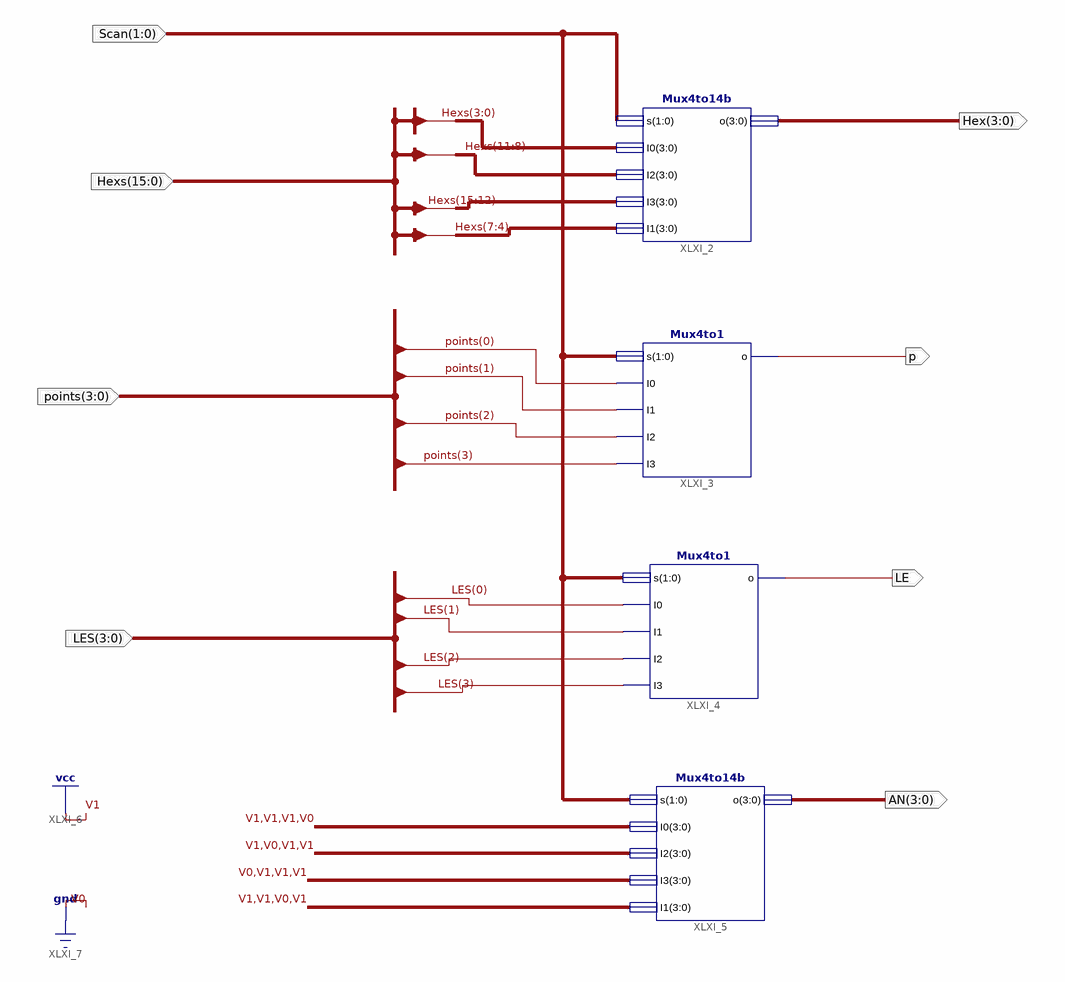
[diagram p0: schematic sheet 1]
// Xilinx ISE schematic DisplaySync.sch (kintex7) as structural Verilog: 4 symbols, 8 ports
module DisplaySync (
  input  [1:0] Scan,
  input  [15:0] Hexs,
  input  [3:0] points,
  input  [3:0] LES,
  output [3:0] Hex,
  output p,
  output LE,
  output [3:0] AN
);

  Mux4to14b XLXI_2 (.s(Scan), .I0(Hexs[3:0]), .I2(Hexs[11:8]), .I3(Hexs[15:12]), .I1(Hexs[7:4]), .o(Hex));
  Mux4to1 XLXI_3 (.s(Scan), .I0(points[0]), .I1(points[1]), .I2(points[2]), .I3(points[3]), .o(p));
  Mux4to1 XLXI_4 (.s(Scan), .I0(LES[0]), .I1(LES[1]), .I2(LES[2]), .I3(LES[3]), .o(LE));
  Mux4to14b XLXI_5 (.s(Scan), .I0(4'b1110), .I2(4'b1011), .I3(4'b0111), .I1(4'b1101), .o(AN));
endmodule
